# Altium project Hydrophones_Array_MMCX_Adapter.PrjPCB
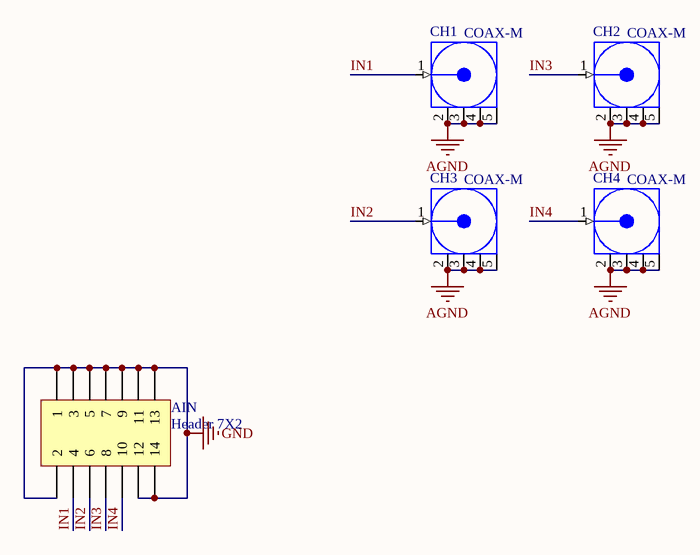
[diagram p0: Hydrophones_Array_MMCX_Adapter.SchDoc]
1 sheet, 5 parts. Net scope: global (net labels, ports and power ports of the same name join across sheets).
Board file: Hydrophones_Array_MMCX_Adapter.PcbDoc

## Sheet Hydrophones_Array_MMCX_Adapter.SchDoc
size A

### Parts
AIN  Header 7X2  [FLE-107-01-G-DV-A-TR]
CH1  COAX-M  [MMCX-J-P-H-ST-TH1]
CH2  COAX-M  [MMCX-J-P-H-ST-TH1]
CH3  COAX-M  [MMCX-J-P-H-ST-TH1]
CH4  COAX-M  [MMCX-J-P-H-ST-TH1]

### Nets
AGND: CH1.2(GND) CH1.3(GND) CH1.4(GND) CH1.5(GND) CH2.2(GND) CH2.3(GND) CH2.4(GND) CH2.5(GND) CH3.2(GND) CH3.3(GND) CH3.4(GND) CH3.5(GND) CH4.2(GND) CH4.3(GND) CH4.4(GND) CH4.5(GND)
GND: AIN.1 AIN.2 AIN.3 AIN.5 AIN.7 AIN.9 AIN.11 AIN.12 AIN.13 AIN.14
IN1: AIN.4 CH1.1(Signal)
IN2: AIN.6 CH3.1(Signal)
IN3: AIN.8 CH2.1(Signal)
IN4: AIN.10 CH4.1(Signal)

### Library data of the parts
AIN = Header 7X2: Header, 7-Pin, Dual row; LatestRevisionDate: 17-Jul-2002; LatestRevisionNote: Re-released for DXP Platform.; Publisher: Altium Limited
CH1-CH4 = COAX-M: RF Coaxial PCB Connector, MMCX; Thru-Hole, Vertical Mount Plug,  50 Ohm Impedance; PackageDocument: Rev. A, 16-Jun-1997; PCB_Layout: Complies with manufacturer's recommendation.; DrillSize: Corresponds to nominal value.; Published: 15-Jul-2004; LatestRevisionDate: 15-Jul-2004; LatestRevisionNote: Component Replaced.; DatasheetDocument: 30-May-2003; PackageReference: 908-21103; Publisher: Altium Limited; ComponentLink1Description: Manufacturer Link; ComponentLink1URL: http://www.amphenolrf.com/